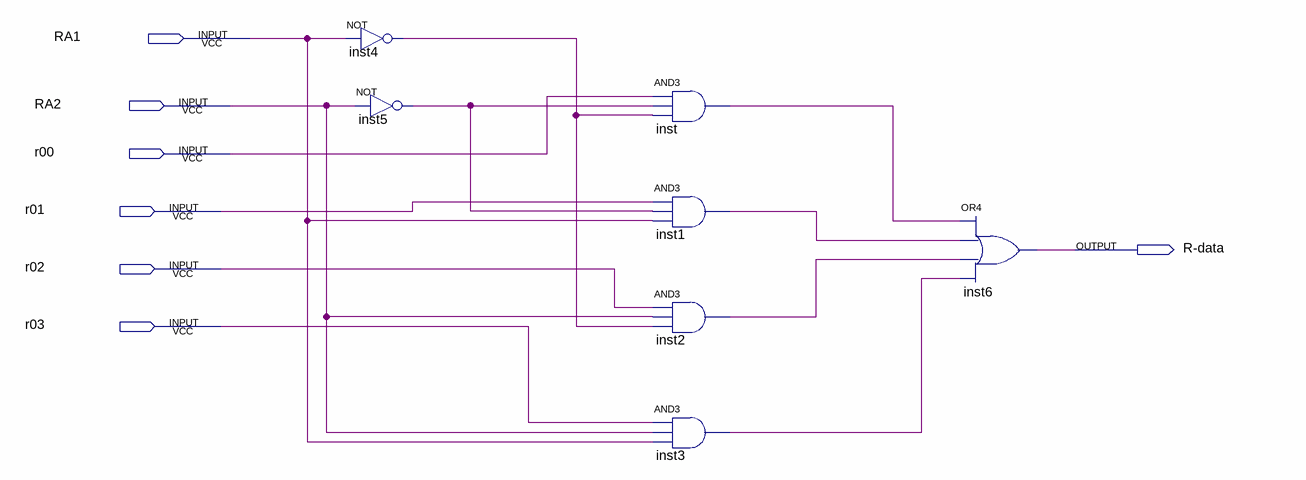
[diagram p0: schematic sheet]
// Quartus schematic 4-2mux.bdf as structural Verilog: 7 symbols, 7 pins
module \4-2mux  (
  input  RA1,
  input  RA2,
  input  r00,
  input  r01,
  input  r02,
  input  r03,
  output \R-data 
);

  wire inst1_out, inst2_out, inst3_out, inst4_out, inst5_out, inst_out;

  not inst4 (inst4_out, RA1);
  not inst5 (inst5_out, RA2);
  and inst (inst_out, r00, inst5_out, inst4_out);
  and inst1 (inst1_out, r01, inst5_out, RA1);
  and inst2 (inst2_out, r02, RA2, inst4_out);
  and inst3 (inst3_out, r03, RA2, RA1);
  or inst6 (\R-data , inst_out, inst1_out, inst2_out, inst3_out);
endmodule
